# EAGLE schematic ColorControl (EAGLE 6.4)
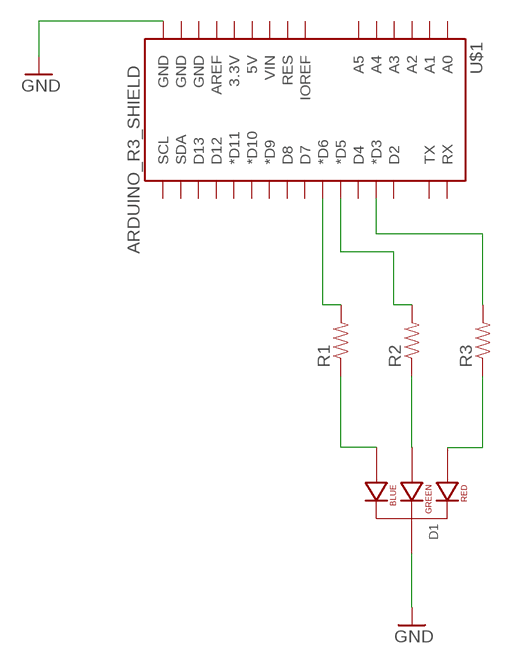
[diagram p0: schematic, sheet 1]

## Parts
D1  LED-RGB-CC-THRUCLEAR  [LED-RGB-THRU]
R1  RESISTORAXIAL-0.3  [AXIAL-0.3]
R2  RESISTORAXIAL-0.3  [AXIAL-0.3]
R3  RESISTORAXIAL-0.3  [AXIAL-0.3]
U$1  ARDUINO_R3_SHIELD  [UNO_R3_SHIELD]

## Nets
GND: D1.2(CATHODE) U$1.GND@0(GND)
N$1: D1.1(RED_CATHODE) R3.P$1
N$2: D1.3(GREEN_CATHODE) R2.P$1
N$3: D1.4(BLUE_CATHODE) R1.P$1
N$4: R3.P$2 U$1.D3(*D3)
N$5: R2.P$2 U$1.D5(*D5)
N$6: R1.P$2 U$1.D6(*D6)
Unconnected: U$1.3.3V U$1.5V U$1.A0 U$1.A1 U$1.A2 U$1.A3 U$1.A4 U$1.A5 U$1.AREF U$1.D2 U$1.D4 U$1.D7 U$1.D8 U$1.D9(*D9) U$1.D10(*D10) U$1.D11(*D11) U$1.D12 U$1.D13 U$1.GND@1(GND) U$1.GND@2(GND) U$1.IOREF U$1.RES U$1.RX U$1.SCL U$1.SDA U$1.TX U$1.VIN

## Library data of the parts
D1 = SparkFun-LED:LED-RGB-CC-THRU: RGB Through-hole common cathode LED SparkFun Storefront: COM-00105 (Clear) COM-09264 (Diffuse); PROD_ID: DIO-08418
R1-R3 = SparkFun-Passives:RESISTOR: Resistor Basic schematic elements and footprints for 0603, 1206, and PTH resistors.
U$1 = SparkFun-Boards:ARDUINO_R3_SHIELD: Shield form compatible with the Arduino Uno R3.